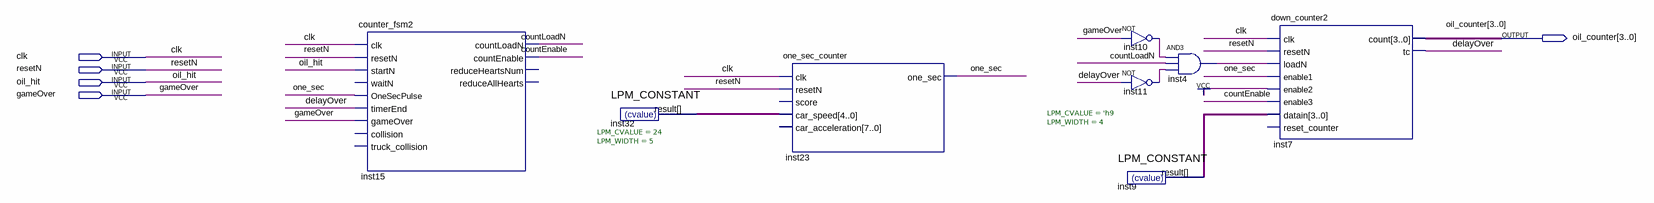
[diagram p0: schematic sheet]
// Quartus schematic down_counter_Block.bdf as structural Verilog: 8 symbols, 5 pins
module down_counter_Block (
  input  clk,
  input  resetN,
  input  oil_hit,
  input  gameOver,
  output [3:0] oil_counter
);

  wire countEnable, countLoadN, delayOver, inst4_out, inst10_out, inst11_out, one_sec;
  wire [3:0] inst9_result;
  wire [4:0] inst32_result;

  counter_fsm2 inst15 (
    .clk(clk), .resetN(resetN), .startN(oil_hit), .OneSecPulse(one_sec), .timerEnd(delayOver),
    .gameOver(gameOver), .countLoadN(countLoadN), .countEnable(countEnable));  // open: waitN, collision, truck_collision, reduceHeartsNum, reduceAllHearts
  LPM_CONSTANT #(.LPM_CVALUE(24), .LPM_WIDTH(5)) inst32 (.result(inst32_result));
  one_sec_counter inst23 (
    .clk(clk), .resetN(resetN), .car_speed(inst32_result), .one_sec(one_sec));  // open: score, car_acceleration
  not inst10 (inst10_out, gameOver);
  not inst11 (inst11_out, delayOver);
  LPM_CONSTANT #(.LPM_CVALUE('h9), .LPM_WIDTH(4)) inst9 (.result(inst9_result));
  and inst4 (inst4_out, inst10_out, countLoadN, inst11_out);
  down_counter2 inst7 (
    .clk(clk), .resetN(resetN), .loadN(inst4_out), .enable1(one_sec), .enable2(1'b1), .enable3(countEnable),
    .datain(inst9_result), .count(oil_counter), .tc(delayOver));  // open: reset_counter
endmodule
